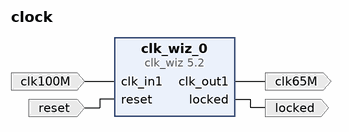
[diagram p0: block diagram of the top level]
# Vivado block design clock, Vivado 2015.4
create_bd_design clock

create_bd_port -dir I -type clk clk100M
set_property -dict {CONFIG.FREQ_HZ 100000000} [get_bd_ports clk100M]
create_bd_port -dir O -type clk clk65M
create_bd_port -dir O locked
create_bd_port -dir I -type rst reset
set_property -dict {CONFIG.POLARITY ACTIVE_HIGH} [get_bd_ports reset]

create_bd_cell -type ip -vlnv xilinx.com:ip:clk_wiz:5.2 clk_wiz_0
set_property -dict [list \
  CONFIG.CLKOUT1_REQUESTED_OUT_FREQ 65.000 \
  CONFIG.MMCM_DIVCLK_DIVIDE 5 \
  CONFIG.MMCM_CLKFBOUT_MULT_F 50.375 \
  CONFIG.MMCM_CLKOUT0_DIVIDE_F 15.500 \
  CONFIG.CLKOUT1_JITTER 254.866 \
  CONFIG.CLKOUT1_PHASE_ERROR 297.890 \
] [get_bd_cells clk_wiz_0]

# ---- connections ----

connect_bd_net [get_bd_ports clk100M] [get_bd_pins clk_wiz_0/clk_in1]
connect_bd_net [get_bd_pins clk_wiz_0/clk_out1] [get_bd_ports clk65M]
connect_bd_net [get_bd_pins clk_wiz_0/locked] [get_bd_ports locked]
connect_bd_net [get_bd_ports reset] [get_bd_pins clk_wiz_0/reset]

validate_bd_design
save_bd_design
